# EAGLE schematic axiom_beta_plugin_module_1xHDMI_v0.6_r1.1.27a912cf (EAGLE 7.7.0)
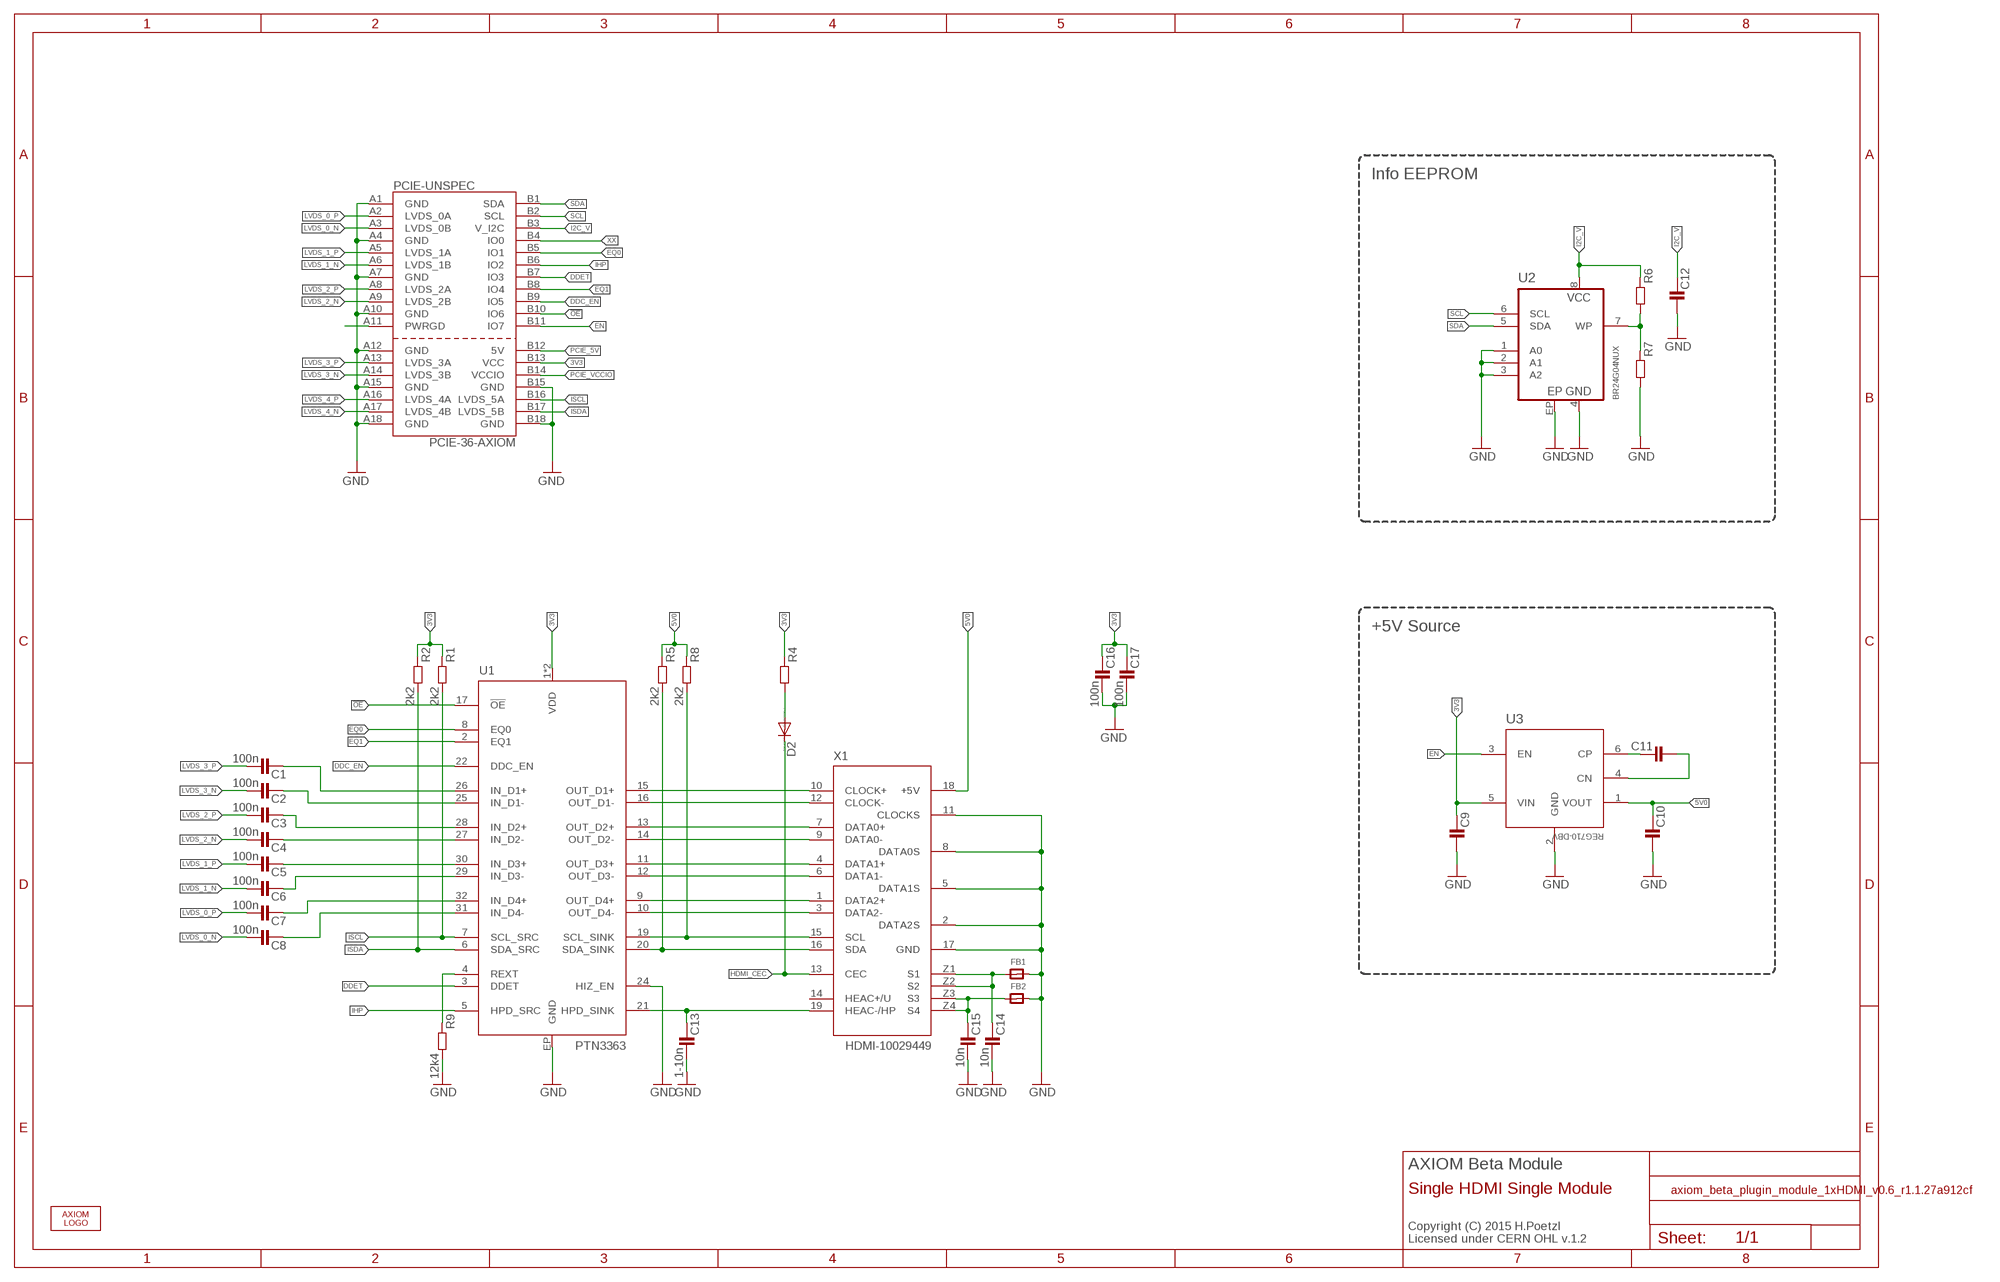
[diagram p0: schematic, sheet 1]

## Parts
C1  100n  C0402-C  [0402-C]
C2  100n  C0402-C  [0402-C]
C3  100n  C0402-C  [0402-C]
C4  100n  C0402-C  [0402-C]
C5  100n  C0402-C  [0402-C]
C6  100n  C0402-C  [0402-C]
C7  100n  C0402-C  [0402-C]
C8  100n  C0402-C  [0402-C]
C9  C0603-B  [0603-B]
C10  C0603-B  [0603-B]
C11  C0603-B  [0603-B]
C12  C0402-B  [0402-B]
C13  1-10n  C0402-B  [0402-B]
C14  10n  C0402-B  [0402-B]
C15  10n  C0402-B  [0402-B]
C16  100n  C0402-B  [0402-B]
C17  100n  C0402-B  [0402-B]
D2  DIODE-SOD523  [SOD523]
FB1  FERRITE_0603MP  [_0603MP]
FB2  FERRITE_0603MP  [_0603MP]
PCIE-UNSPEC  PCIE-36-AXIOM  [PCIE-36-AXIOM]
R1  2k2  R0402-B  [0402-B]
R2  2k2  R0402-B  [0402-B]
R4  R0402-B  [0402-B]
R5  2k2  R0402-B  [0402-B]
R6  R0402-B  [0402-B]
R7  R0402-B  [0402-B]
R8  2k2  R0402-B  [0402-B]
R9  12k4  R0402-B  [0402-B]
U1  PTN3363  [HVQFN32]
U2  BR24G04NUX  [DFN200X300X100-9N]
U3  REG710-DBV  [DBV]
U$1  AXIOM_LOGO459X70  [AXIOM_LOGO_459X70]
X1  HDMI-10029449  [10029449-X01XLF]

## Nets
3V3: C9.1 C16.1 C17.1 PCIE-UNSPEC.B13(VCC) R1.1 R2.1 R4.1 U1.1(VDD) U1.18(VDD) U3.5(VIN)
5V0: C10.1 R5.1 R8.1 U3.1(VOUT) X1.18(+5V)
!OE!: PCIE-UNSPEC.B10(IO6) U1.17(!OE!)
CLOCK_N [power]: U1.16(OUT_D1-) X1.12(CLOCK-)
CLOCK_P [power]: U1.15(OUT_D1+) X1.10(CLOCK+)
DATA0_N [power]: U1.14(OUT_D2-) X1.9(DATA0-)
DATA0_P [power]: U1.13(OUT_D2+) X1.7(DATA0+)
DATA1_N [power]: U1.12(OUT_D3-) X1.6(DATA1-)
DATA1_P [power]: U1.11(OUT_D3+) X1.4(DATA1+)
DATA2_N [power]: U1.10(OUT_D4-) X1.3(DATA2-)
DATA2_P [power]: U1.9(OUT_D4+) X1.1(DATA2+)
DDC_EN: PCIE-UNSPEC.B9(IO5) U1.22(DDC_EN)
DDET: PCIE-UNSPEC.B7(IO3) U1.3(DDET)
EN: PCIE-UNSPEC.B11(IO7) U3.3(EN)
EQ0: PCIE-UNSPEC.B5(IO1) U1.8(EQ0)
EQ1: PCIE-UNSPEC.B8(IO4) U1.2(EQ1)
GND: C9.2 C10.2 C12.2 C13.2 C14.2 C15.2 C16.2 C17.2 FB1.2 FB2.2 PCIE-UNSPEC.A1(GND) PCIE-UNSPEC.A4(GND) PCIE-UNSPEC.A7(GND) PCIE-UNSPEC.A10(GND) PCIE-UNSPEC.A12(GND) PCIE-UNSPEC.A15(GND) PCIE-UNSPEC.A18(GND) PCIE-UNSPEC.B15(GND) PCIE-UNSPEC.B18(GND) R7.2 R9.2 U1.24(HIZ_EN) U1.EP(GND) U2.1(A0) U2.2(A1) U2.3(A2) U2.4(GND) U2.EP U3.2(GND) X1.2(DATA2S) X1.5(DATA1S) X1.8(DATA0S) X1.11(CLOCKS) X1.17(GND)
HDMI_CEC: D2.C X1.13(CEC)
HDMI_HP: C13.1 U1.21(HPD_SINK) X1.19(HEAC-/HP)
HDMI_SCL: R8.2 U1.19(SCL_SINK) X1.15(SCL)
HDMI_SDA: R5.2 U1.20(SDA_SINK) X1.16(SDA)
I2C_V: C12.1 PCIE-UNSPEC.B3(V_I2C) R6.1 U2.8(VCC)
IHP: PCIE-UNSPEC.B6(IO2) U1.5(HPD_SRC)
IN_D1_N: C2.1 U1.25(IN_D1-)
IN_D1_P: C1.1 U1.26(IN_D1+)
IN_D2_N: C4.1 U1.27(IN_D2-)
IN_D2_P: C3.1 U1.28(IN_D2+)
IN_D3_N: C6.1 U1.29(IN_D3-)
IN_D3_P: C5.1 U1.30(IN_D3+)
IN_D4_N: C8.1 U1.31(IN_D4-)
IN_D4_P: C7.1 U1.32(IN_D4+)
ISCL: PCIE-UNSPEC.B16(LVDS_5A) R1.2 U1.7(SCL_SRC)
ISDA: PCIE-UNSPEC.B17(LVDS_5B) R2.2 U1.6(SDA_SRC)
LVDS_0_N: C8.2 PCIE-UNSPEC.A3(LVDS_0B)
LVDS_0_P: C7.2 PCIE-UNSPEC.A2(LVDS_0A)
LVDS_1_N [power]: C6.2 PCIE-UNSPEC.A6(LVDS_1B)
LVDS_1_P [power]: C5.2 PCIE-UNSPEC.A5(LVDS_1A)
LVDS_2_N [power]: C4.2 PCIE-UNSPEC.A9(LVDS_2B)
LVDS_2_P [power]: C3.2 PCIE-UNSPEC.A8(LVDS_2A)
LVDS_3_N [power]: C2.2 PCIE-UNSPEC.A14(LVDS_3B)
LVDS_3_P [power]: C1.2 PCIE-UNSPEC.A13(LVDS_3A)
LVDS_4_N [power]: PCIE-UNSPEC.A17(LVDS_4B)
LVDS_4_P [power]: PCIE-UNSPEC.A16(LVDS_4A)
N$1: C11.1 U3.6(CP)
N$5: C11.2 U3.4(CN)
N$6: C14.1 FB1.1 X1.Z1(S1) X1.Z2(S2)
N$12: R6.2 R7.1 U2.7(WP)
N$15: C15.1 FB2.1 X1.Z3(S3) X1.Z4(S4)
N$31: R9.1 U1.4(REXT)
N$45: D2.A R4.2
N$209: PCIE-UNSPEC.A11(PWRGD)
PCIE_5V: PCIE-UNSPEC.B12(5V)
PCIE_VCCIO: PCIE-UNSPEC.B14(VCCIO)
SCL: PCIE-UNSPEC.B2(SCL) U2.6(SCL)
SDA: PCIE-UNSPEC.B1(SDA) U2.5(SDA)
XX: PCIE-UNSPEC.B4(IO0)
Unconnected: X1.14(HEAC+/U)

## Notes on the sheet
- Info EEPROM
- +5V Source
- AXIOM Beta Module
- Single HDMI Single Module
- Copyright (C) 2015 H.Poetzl
  Licensed under CERN OHL v.1.2

## Library data of the parts
C1-C17 = generic-rcl:C
D2 = diode:DIODE-: DIODE
FB1 FB2 = microbuilder:FERRITE: Ferrite Bead 0603 MMZ1608B121C - 120 Ohm @ 100MHz, 600mA, 0.15 Ohm DC Resistance - Digikey: 445-2164-1-ND BK1608HW121-T - 120 Ohm, 600mA Ferrite Chip - Digikey: 587-1876-2-ND 0805 HZ0805B272R-10 - 2.7K Ohm @ 100MHz, 200mA, 0.8 Ohm DC Resistance - Digikey: 240-2504-1-ND (see also Murata BLM21BD272SN1L) MMZ2012Y152B - 1.5K Ohm @ 100MHz, 500mA, 0.4 Ohm DC Resistance - Digikey: 445-1560-1-ND - Mainly for high frequency (80-400MHz) MMZ2012R102A - 1K Ohm @ 100MHz, 500mA, 0.3 Ohm DC Resistance - Digikey: 445-1555-2-ND - More general purpose (10-200MHz)
PCIE-UNSPEC = PCIe:PCIE-36-AXIOM
R1 R2 R4-R9 = generic-rcl:R
U1 = ptn3363:PTN3363
U2 = eeprom:BR24G04
U3 = reg710:REG710: Buck/Boost Charge Pump 60mA
U$1 = logos_apertus_axiom:AXIOM_LOGO
X1 = hdmi:HDMI

## Net classes
0 default: width 0.152 mm, drill 0.203 mm
1 power: width 0.152 mm, drill 0.203 mm